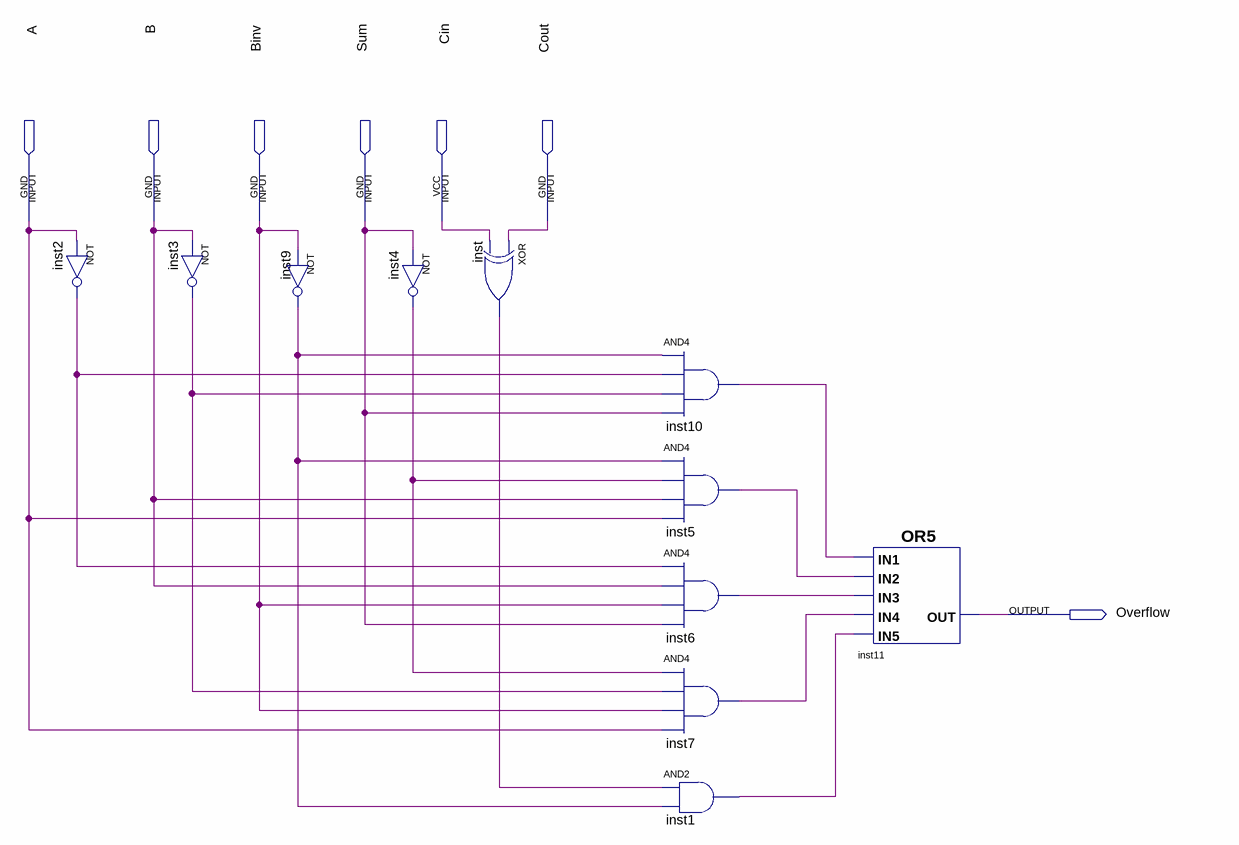
[diagram p0: schematic sheet]
// Quartus schematic Detector_Overflow.bdf as structural Verilog: 11 symbols, 7 pins
module Detector_Overflow (
  input  A,
  input  B,
  input  Binv,
  input  Sum,
  input  Cin,
  input  Cout,
  output Overflow
);

  wire inst1_out, inst2_out, inst3_out, inst4_out, inst5_out, inst6_out, inst7_out, inst9_out, inst10_out,
       inst_out;

  not inst2 (inst2_out, A);
  not inst3 (inst3_out, B);
  not inst9 (inst9_out, Binv);
  not inst4 (inst4_out, Sum);
  xor inst (inst_out, Cout, Cin);
  and inst10 (inst10_out, inst9_out, inst2_out, inst3_out, Sum);
  and inst5 (inst5_out, inst9_out, inst4_out, B, A);
  and inst6 (inst6_out, inst2_out, B, Binv, Sum);
  and inst7 (inst7_out, inst4_out, inst3_out, Binv, A);
  and inst1 (inst1_out, inst_out, inst9_out);
  or inst11 (Overflow, inst10_out, inst5_out, inst6_out, inst7_out, inst1_out);
endmodule
